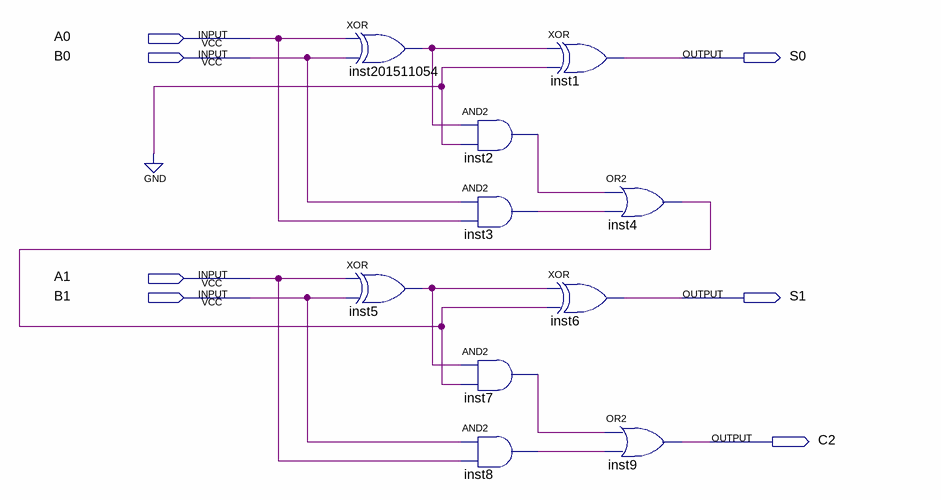
[diagram p0: schematic sheet]
// Quartus schematic lab03_1.bdf as structural Verilog: 10 symbols, 7 pins
module lab03_1 (
  input  A0,
  input  B0,
  input  A1,
  input  B1,
  output S0,
  output S1,
  output C2
);

  wire inst2_out, inst3_out, inst4_out, inst5_out, inst7_out, inst8_out, inst201511054_out;

  xor inst201511054 (inst201511054_out, A0, B0);
  xor inst5 (inst5_out, A1, B1);
  and inst2 (inst2_out, inst201511054_out, 1'b0);
  and inst3 (inst3_out, B0, A0);
  and inst7 (inst7_out, inst5_out, inst4_out);
  and inst8 (inst8_out, B1, A1);
  xor inst1 (S0, inst201511054_out, 1'b0);
  or inst4 (inst4_out, inst2_out, inst3_out);
  xor inst6 (S1, inst5_out, inst4_out);
  or inst9 (C2, inst7_out, inst8_out);
endmodule
